# Altium project BW1097_R2M2E3.PrjPcb (part 10 of 10)
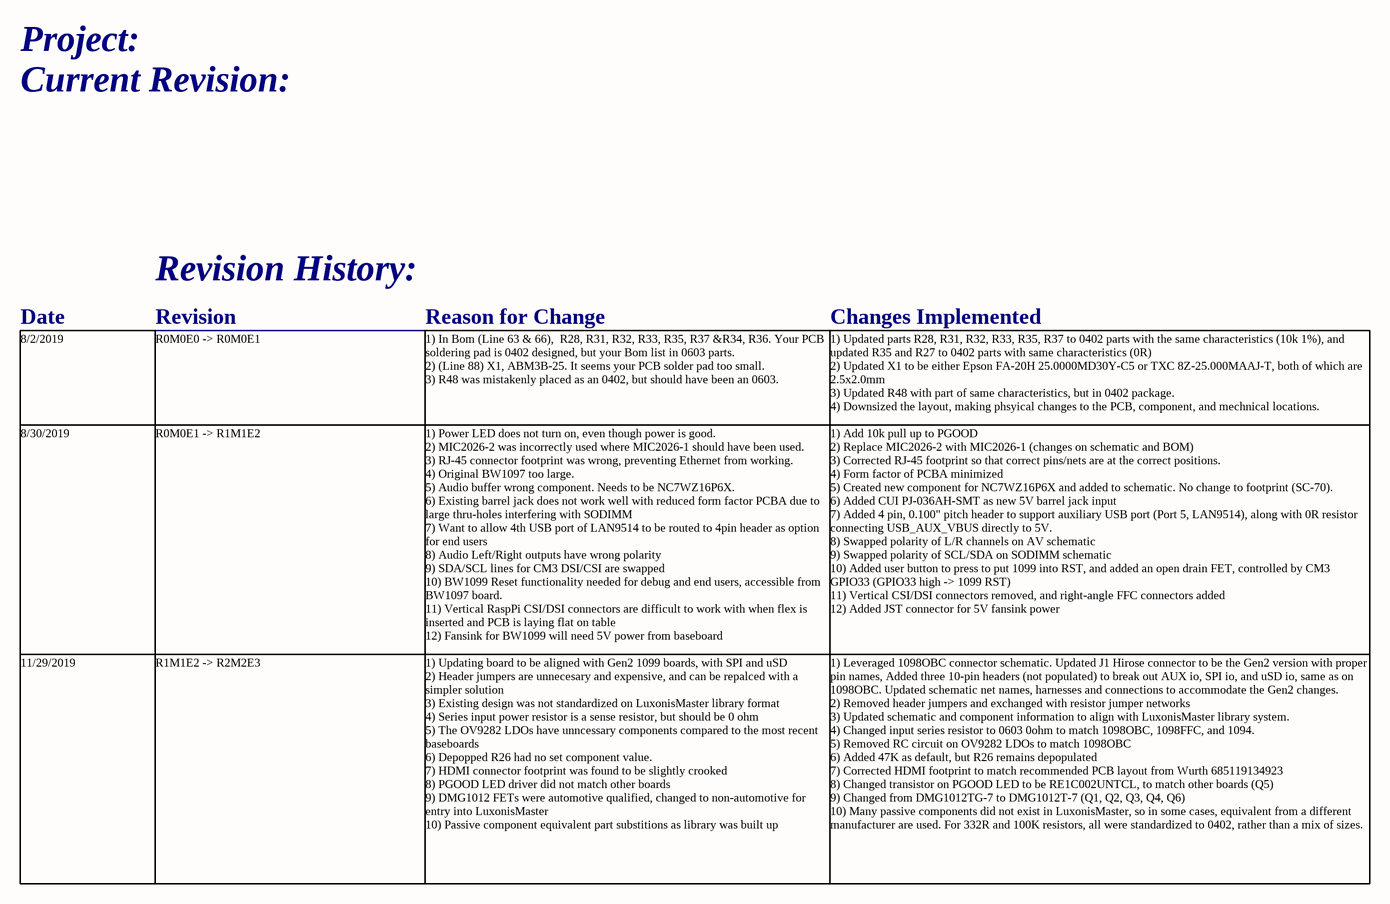
[diagram p14: Project_Information.SchDoc]

## Nets that join several sheets
1V2: BW1097_LEFT_OV9282 (FB8.1), BW1097_Power_Supply (C22.2 U3.5)
1V8: BW1097_SODIMM (R63.1), BW1097_BootSel (R3.2), BW1097_GPIOHDR (R86.1 R87.1 R88.1 R88.2), BW1097_LEFT_OV9282 (FB6.1), BW1097_Power_Supply (5 pins), BW1097_HDMI (R27.2)
2V8: BW1097_SODIMM (R65.1), BW1097_LEFT_OV9282 (FB4.1), BW1097_Power_Supply (C25.2 U5.5)
3V3: BW1097_SODIMM (6 pins), BW1097_uSD (C87.2 J23.4), BW1097_BootSel (R1.2), BW1097_GPIOHDR (7 pins), BW1097_HUB (18 pins), BW1097_EthernetSchDoc (J4.9 J4.12 R5.2), BW1097_MIPI_IO (J13.P1 J13.P2 J14.P1), BW1097_Power_Supply (8 pins), BW1097_HDMI (R26.2)
3V3_VDDA: BW1097_HUB (16 pins), BW1097_EthernetSchDoc (5 pins), BW1097_AV (C95.2 U9.5)
GND: BW1097_TopLevel (MTG1.1 MTG2.1 MTG3.1 MTG4.1), BW1097_Connector (50 pins), BW1097_SODIMM (74 pins), BW1097_uSD (7 pins), BW1097_BootSel (J2.3 Q2.2 R2.1), BW1097_GPIOHDR (12 pins), BW1097_HUB (54 pins), BW1097_EthernetSchDoc (6 pins), BW1097_MIPI_IO (9 pins), BW1097_AV (9 pins), BW1097_LEFT_OV9282 (16 pins), BW1097_Power_Supply (45 pins), BW1097_HDMI (15 pins)
VBUS: BW1097_Connector (J1.53), BW1097_HUB (C77.2 C78.2 R41.1 R42.2)
VBUSB: BW1097_BootSel (J2.1), BW1097_HUB (J21.1 Q6.1 R39.2)
VDD_5V: BW1097_Connector (11 pins), BW1097_SODIMM (R67.1), BW1097_GPIOHDR (C9.2 J9.2 J9.4), BW1097_HUB (R41.2 R78.2 U8.7), BW1097_Power_Supply (20 pins), BW1097_HDMI (C10.2 U1.3)
CAM1_CLK_N: BW1097_SODIMM (J24.149), BW1097_MIPI_IO (J14.P8)
CAM1_CLK_P: BW1097_SODIMM (J24.147), BW1097_MIPI_IO (J14.P7)
CAM1_D0_N: BW1097_SODIMM (J24.161), BW1097_MIPI_IO (J14.P14)
CAM1_D0_P: BW1097_SODIMM (J24.159), BW1097_MIPI_IO (J14.P13)
CAM1_D1_N: BW1097_SODIMM (J24.155), BW1097_MIPI_IO (J14.P11)
CAM1_D1_P: BW1097_SODIMM (J24.153), BW1097_MIPI_IO (J14.P10)
CAM_B_CLK_OUT: BW1097_Connector (J1.73), BW1097_LEFT_OV9282 (J18.24)
CAM_B_PWDN_N: BW1097_Connector (J1.67), BW1097_LEFT_OV9282 (J18.22 R33.1)
CD1_SCL: BW1097_SODIMM (J24.5 R57.1), BW1097_MIPI_IO (J13.P5 J14.P3)
CD1_SDA: BW1097_SODIMM (J24.3 R56.1), BW1097_MIPI_IO (J13.P4 J14.P2)
COM_AUX_IO2: BW1097_Connector (J1.42 TP10.1), BW1097_LEFT_OV9282 (R37.1)
DSI1_CLK_N: BW1097_SODIMM (J24.102), BW1097_MIPI_IO (J13.P11)
DSI1_CLK_P: BW1097_SODIMM (J24.100), BW1097_MIPI_IO (J13.P10)
DSI1_D0_N: BW1097_SODIMM (J24.96), BW1097_MIPI_IO (J13.P8)
DSI1_D0_P: BW1097_SODIMM (J24.94), BW1097_MIPI_IO (J13.P7)
DSI1_D1_N: BW1097_SODIMM (J24.120), BW1097_MIPI_IO (J13.P14)
DSI1_D1_P: BW1097_SODIMM (J24.118), BW1097_MIPI_IO (J13.P13)
EMMC_DISABLE_N: BW1097_SODIMM (J24.2), BW1097_BootSel (Q1.3)
EMMC_EN_N_1V8: BW1097_SODIMM (J24.90), BW1097_BootSel (Q2.1 R3.1)
GPIO0-27_VREF: BW1097_SODIMM (J24.39 J24.40), BW1097_GPIOHDR (C6.2 R32.2 R86.2 R90.1)
GPIO2/SDA1: BW1097_SODIMM (J24.9 R54.1), BW1097_GPIOHDR (J9.3)
GPIO3/SCL1: BW1097_SODIMM (J24.11 R55.1), BW1097_GPIOHDR (J9.5)
GPIO4/GPIO_GCLK/CAM1_IO1: BW1097_SODIMM (J24.15), BW1097_GPIOHDR (J9.7), BW1097_MIPI_IO (J14.P4)
GPIO5/CAM1_IO0: BW1097_SODIMM (J24.17), BW1097_GPIOHDR (J9.29), BW1097_MIPI_IO (J14.P5)
GPIO6: BW1097_SODIMM (J24.21), BW1097_GPIOHDR (J9.31)
GPIO7/SPI_CE1_N: BW1097_SODIMM (J24.23), BW1097_GPIOHDR (J9.26)
GPIO8/SPI_CE0_N: BW1097_SODIMM (J24.27), BW1097_GPIOHDR (J9.24)
GPIO9/SPI_MISO: BW1097_SODIMM (J24.29), BW1097_GPIOHDR (J9.21)
GPIO10/SPI_MOSI: BW1097_SODIMM (J24.33), BW1097_GPIOHDR (J9.19)
GPIO11/SPI_SCLK: BW1097_SODIMM (J24.35), BW1097_GPIOHDR (J9.23)
GPIO12: BW1097_SODIMM (J24.45), BW1097_GPIOHDR (J9.32)
GPIO13: BW1097_SODIMM (J24.47), BW1097_GPIOHDR (J9.33)
GPIO14/TXD0: BW1097_SODIMM (J24.51), BW1097_GPIOHDR (J9.8)
GPIO15/RXD0: BW1097_SODIMM (J24.53), BW1097_GPIOHDR (J9.10)
GPIO16: BW1097_SODIMM (J24.57), BW1097_GPIOHDR (J9.36)
GPIO17/GPI0_GEN0: BW1097_SODIMM (J24.59), BW1097_GPIOHDR (J9.11)
GPIO18/GPI0_GEN1: BW1097_SODIMM (J24.63), BW1097_GPIOHDR (J9.12)
GPIO19: BW1097_SODIMM (J24.65), BW1097_GPIOHDR (J9.35)
GPIO20: BW1097_SODIMM (J24.69), BW1097_GPIOHDR (J9.38)
GPIO21: BW1097_SODIMM (J24.71), BW1097_GPIOHDR (J9.40)
GPIO22/GPIO_GEN3: BW1097_SODIMM (J24.75), BW1097_GPIOHDR (J9.15)
GPIO23/GPIO_GEN4: BW1097_SODIMM (J24.77), BW1097_GPIOHDR (J9.16)
GPIO24/GPIO_GEN5: BW1097_SODIMM (J24.81), BW1097_GPIOHDR (J9.18)
GPIO25/GPIO_GEN6: BW1097_SODIMM (J24.83), BW1097_GPIOHDR (J9.22)
GPIO26: BW1097_SODIMM (J24.87), BW1097_GPIOHDR (J9.37)
GPIO27/GPIO_GEN2: BW1097_SODIMM (J24.89), BW1097_GPIOHDR (J9.13)
GPIO28-45_VREF: BW1097_SODIMM (J24.41 J24.42), BW1097_GPIOHDR (C7.2 R31.1 R32.1 R87.2)
GPIO32/MPGOOD: BW1097_Connector (R74.2), BW1097_SODIMM (J24.46)
GPIO33/MRST: BW1097_Connector (M1.1 R75.2), BW1097_SODIMM (J24.48)
GPIO34/CD_SW1: BW1097_SODIMM (J24.52), BW1097_uSD (R52.2)
GPIO35/MWAKE: BW1097_Connector (R76.2), BW1097_SODIMM (J24.54)
GPIO40/AUD_R: BW1097_SODIMM (J24.70), BW1097_AV (U9.3)
GPIO41/AUD_L: BW1097_SODIMM (J24.72), BW1097_AV (U9.1)
HDMI_CEC: BW1097_SODIMM (J24.171), BW1097_HDMI (Q3.2 R26.1)
HDMI_CLK_N: BW1097_SODIMM (J24.111), BW1097_HDMI (J10.12)
HDMI_CLK_P: BW1097_SODIMM (J24.113), BW1097_HDMI (J10.10)
HDMI_D0_N: BW1097_SODIMM (J24.117), BW1097_HDMI (J10.9)
HDMI_D0_P: BW1097_SODIMM (J24.119), BW1097_HDMI (J10.7)
HDMI_D1_N: BW1097_SODIMM (J24.123), BW1097_HDMI (J10.6)
HDMI_D1_P: BW1097_SODIMM (J24.125), BW1097_HDMI (J10.4)
HDMI_D2_N: BW1097_SODIMM (J24.129), BW1097_HDMI (J10.3)
HDMI_D2_P: BW1097_SODIMM (J24.131), BW1097_HDMI (J10.1)
HDMI_HPD_N_1V8: BW1097_SODIMM (J24.88), BW1097_HDMI (Q4.3 R27.1)
HDMI_SCL: BW1097_SODIMM (J24.175), BW1097_HDMI (J10.15 U2.A3)
HDMI_SDA: BW1097_SODIMM (J24.173), BW1097_HDMI (J10.16 U2.B3)
I2C2_SCL: BW1097_Connector (J1.77), BW1097_LEFT_OV9282 (J18.21)
I2C2_SDA: BW1097_Connector (J1.79), BW1097_LEFT_OV9282 (J18.20)
MIPI_RX2_C_N: BW1097_Connector (J1.95), BW1097_LEFT_OV9282 (J18.11)
MIPI_RX2_C_P: BW1097_Connector (J1.97), BW1097_LEFT_OV9282 (J18.10)
MIPI_RX2_D0_N: BW1097_Connector (J1.89), BW1097_LEFT_OV9282 (J18.8)
MIPI_RX2_D0_P: BW1097_Connector (J1.91), BW1097_LEFT_OV9282 (J18.7)
MIPI_RX2_D1_N: BW1097_Connector (J1.83), BW1097_LEFT_OV9282 (J18.5)
MIPI_RX2_D1_P: BW1097_Connector (J1.85), BW1097_LEFT_OV9282 (J18.4)
nFDX_LED: BW1097_HUB (U7.20), BW1097_EthernetSchDoc (D2.1)
nLNKA_LED: BW1097_HUB (U7.21), BW1097_EthernetSchDoc (R16.1)
nSPD_LED: BW1097_HUB (U7.22), BW1097_EthernetSchDoc (R23.1)
RX_N: BW1097_HUB (U7.53), BW1097_EthernetSchDoc (C3.2 J4.6 R20.1)
RX_P: BW1097_HUB (U7.52), BW1097_EthernetSchDoc (C2.2 J4.3 R19.1)
SDX_CLK: BW1097_SODIMM (J24.10), BW1097_uSD (J23.5)
SDX_CMD: BW1097_SODIMM (J24.12), BW1097_uSD (J23.3)
SDX_D0: BW1097_SODIMM (J24.16), BW1097_uSD (J23.7)
SDX_D1: BW1097_SODIMM (J24.18), BW1097_uSD (J23.8)
SDX_D2: BW1097_SODIMM (J24.22), BW1097_uSD (J23.1)
SDX_D3: BW1097_SODIMM (J24.24), BW1097_uSD (J23.2)
TX_N: BW1097_HUB (U7.56), BW1097_EthernetSchDoc (C5.2 J4.2 R18.1)
TX_P: BW1097_HUB (U7.55), BW1097_EthernetSchDoc (C4.2 J4.1 R17.1)
USB_D_N: BW1097_SODIMM (J24.167), BW1097_HUB (U6.2)
USB_D_P: BW1097_SODIMM (J24.165), BW1097_HUB (U6.1)
USBD2_N: BW1097_Connector (J1.18), BW1097_HUB (U7.1)
USBD2_P: BW1097_Connector (J1.16), BW1097_HUB (U7.2)

## Assembly variants
Production: not fitted C2 C3 C4 C5 C23 C23 C26 C42 C43 C45 C84 D3 J5 J7 J8 J12 J28 J29 R24 R25 R26 R32 R52 R53 R74 R76 R79 R81 R82 R83 R84 R86 R87 R88 R89 U10